# Altium schematic sheet 1_EVB-A32S1-M_Power.SchDoc
size A4; SheetNumber: 1; SheetTotal: 4
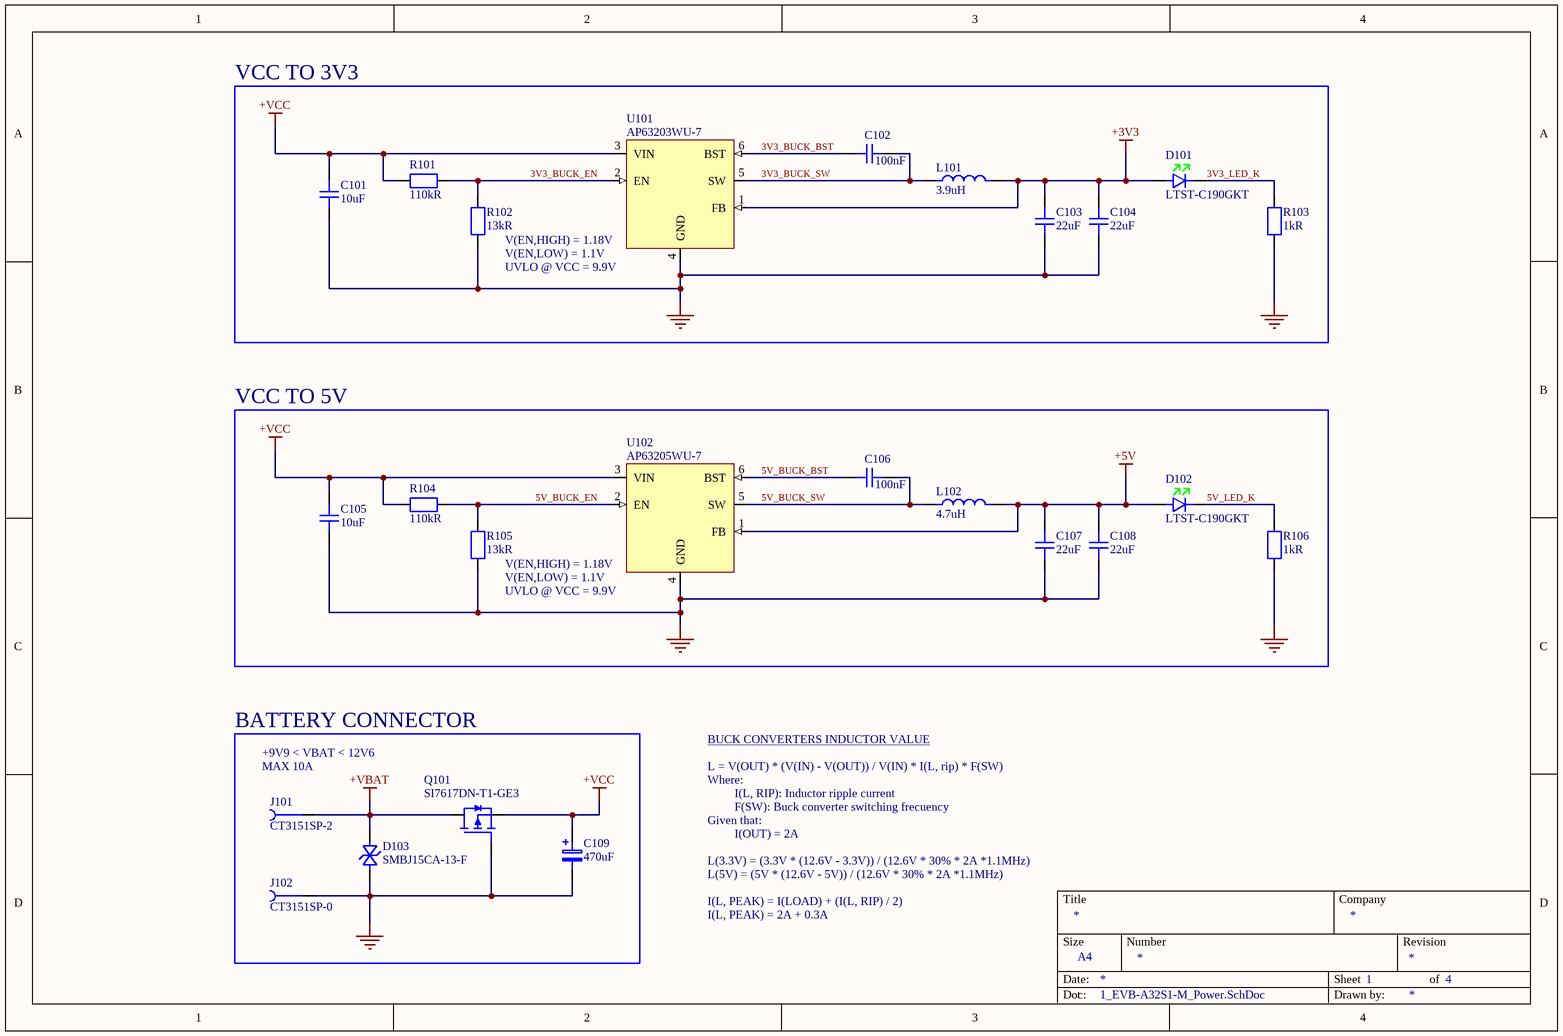
[diagram p0: 1_EVB-A32S1-M_Power.SchDoc]

## Parts
C101  value 10uF  [C_Samsung_CL_0805_A]  (hidden comment: CL21A106KOQNNNE)
C102  value 100nF  [C_Samsung_CL_0402_A]  (hidden comment: CL05B104KP5NNNC)
C103  value 22uF  [C_Yageo_CC_0805_A]  (hidden comment: CC0805MKX5R6BB226)
C104  value 22uF  [C_Yageo_CC_0805_A]  (hidden comment: CC0805MKX5R6BB226)
C105  value 10uF  [C_Samsung_CL_0805_A]  (hidden comment: CL21A106KOQNNNE)
C106  value 100nF  [C_Samsung_CL_0402_A]  (hidden comment: CL05B104KP5NNNC)
C107  value 22uF  [C_Yageo_CC_0805_A]  (hidden comment: CC0805MKX5R6BB226)
C108  value 22uF  [C_Yageo_CC_0805_A]  (hidden comment: CC0805MKX5R6BB226)
C109  value 470uF  [C_Rubycon_10x16mm_TH]  (hidden comment: 35ZLH470MEFC10X16)
D101  LTST-C190GKT  [D_LED_Lite-On_Green_0603_A]
D102  LTST-C190GKT  [D_LED_Lite-On_Green_0603_A]
D103  SMBJ15CA-13-F  [D_TVS_BI_Diodes_SMBJ15CA-13-F_A]
J101  CT3151SP-2  [J_CalTest_CT3151SP-2]
J102  CT3151SP-0  [J_CalTest_CT3151SP-0]
L101  value 3.9uH  [L_Murata_1255AY-XXXX=P3]  (hidden comment: 1255AY-3R9N=P3)
L102  value 4.7uH  [L_Murata_1255AY-XXXX=P3]  (hidden comment: 1255AY-4R7M=P3)
Q101  SI7617DN-T1-GE3  [Q_Vishay_PowerPACK-1212-8]
R101  value 110kR  [R_Yageo_RCL_0402_A]  (hidden comment: RC0402FR-07110KL)
R102  value 13kR  [R_Yageo_RCL_0402_A]  (hidden comment: RC0402FR-0713KL)
R103  value 1kR  [R_Yageo_RCL_0402_A]  (hidden comment: RC0402FR-071KL)
R104  value 110kR  [R_Yageo_RCL_0402_A]  (hidden comment: RC0402FR-07110KL)
R105  value 13kR  [R_Yageo_RCL_0402_A]  (hidden comment: RC0402FR-0713KL)
R106  value 1kR  [R_Yageo_RCL_0402_A]  (hidden comment: RC0402FR-071KL)
U101  AP63203WU-7  [U_Diodes_AP623xx]
U102  AP63205WU-7  [U_Diodes_AP623xx]

## Blocks framed on the sheet
VCC TO 3V3: C101-C104 D101 L101 R101-R103 U101
VCC TO 5V: C105-C108 D102 L102 R104-R106 U102
BATTERY CONNECTOR: C109 D103 J101 J102 Q101

## Nets
+3V3: C103.2 C104.2 D101.2 L101.2 U101.1(FB)
+5V: C107.2 C108.2 D102.2 L102.2 U102.1(FB)
+VBAT: D103.1 J101.1 Q101.1(D)
+VCC: C101.2 C105.2 C109.1 Q101.3(S) R101.2 R104.2 U101.3(VIN) U102.3(VIN)
GND: C101.1 C103.1 C104.1 C105.1 C107.1 C108.1 C109.2 D103.2 J102.1 Q101.2(G) R102.1 R103.1 R105.1 R106.1 U101.4(GND) U102.4(GND)
3V3_BUCK_BST: C102.2 U101.6(BST)
3V3_BUCK_EN: R101.1 R102.2 U101.2(EN)
3V3_BUCK_SW: C102.1 L101.1 U101.5(SW)
3V3_LED_K: D101.1 R103.2
5V_BUCK_BST: C106.2 U102.6(BST)
5V_BUCK_EN: R104.1 R105.2 U102.2(EN)
5V_BUCK_SW: C106.1 L102.1 U102.5(SW)
5V_LED_K: D102.1 R106.2

## Notes on the sheet
- (near U101) V(EN,HIGH) = 1.18V
- V(EN,LOW) = 1.1V
- (near U101) UVLO @ VCC = 9.9V
- (near U102) V(EN,HIGH) = 1.18V
- (near U102) UVLO @ VCC = 9.9V
- +9V9 < VBAT < 12V6
- (near J101) MAX 10A
- L = V(OUT) * (V(IN) - V(OUT)) / V(IN) * I(L, rip) * F(SW)
- BUCK CONVERTERS INDUCTOR VALUE
- Where:
- Given that:
- I(L, RIP): Inductor ripple current
- F(SW): Buck converter switching frecuency
- I(OUT) = 2A
- L(3.3V) = (3.3V * (12.6V - 3.3V)) / (12.6V * 30% * 2A *1.1MHz)
- L(5V) = (5V * (12.6V - 5V)) / (12.6V * 30% * 2A *1.1MHz)
- I(L, PEAK) = I(LOAD) + (I(L, RIP) / 2)
- I(L, PEAK) = 2A + 0.3A
- Title
- Company
- Size
- Date:
- A4
- Number
- Sheet
- Revision
- of
- Doc:
- Drawn by:

## Library data of the parts
C101 C105 = CMP-001-00022-4: Multilayer Ceramic Capacitor, 10 uF, 16 V, ± 10%, X5R, 0805 [2012 Metric]; Voltage Rating (DC): 16V; Dielectric: X7R; Radiation Hardening: No; Width: 0.049inch; Series: CL; Lead Free: Lead Free; Case/Package: 0805; Case Code (Metric): 2012; Construction: Flat; Height: 1.25mm; Voltage: 16V; Packaging: Tape and Reel; Voltage Rating: 16V; RoHS Compliant: Yes; Mounting Technology: Surface Mount; Case Code (Imperial): 0805; Length: 2mm; Min Operating Temperature: -55°C; Max Operating Temperature: 85°C; Depth: 1.25mm; Tolerance: 10%; Thickness: 0.055inch; ComponentLink1URL: https://mm.digikey.com/Volume0/opasdata/d220001/medias/docus/609/CL21A106KOQNNNE_Spec.pdf; Material: Ceramic; Package Quantity: 1; ComponentLink1Description: Datasheet
C102 C106 = CMP-001-00023-3: Multilayer Ceramic Capacitor, 0.1 uF, 10 V, ± 10%, X7R, 0402 [1005 Metric]; Voltage Rating: 10V; Dielectric: X7R; Height: 0.5mm; Tolerance: 10%; Voltage Rating (DC): 10V; Case/Package: 0402; RoHS Compliant: Yes; Packaging: Tape and Reel; Case Code (Imperial): 0402; Material: Ceramic; Case Code (Metric): 1005; Max Operating Temperature: 125°C; Mounting Technology: Surface Mount; Min Operating Temperature: -55°C; Series: CL; Construction: Flat; Depth: 0.5mm; Length: 1mm; Package Quantity: 1; Radiation Hardening: No; Thickness: 0.022inch; Width: 0.02inch
C103 C104 C107 C108 = CMP-001-00014-9: Multilayer Ceramic Capacitor, 22 uF, 10 V, ± 20%, X5R, 0805 [2012 Metric]; Voltage Rating (DC): 10V; Tolerance: 20%; ComponentLink1URL: https://www.yageo.com/upload/media/product/app/datasheet/mlcc/upy-gphc_x5r_4v-to-50v.pdf; Depth: 1.25mm; Width: 0.049inch; Termination: SMD/SMT; Packaging: Tape and Reel; Radiation Hardening: No; Min Operating Temperature: -55°C; RoHS Compliant: Yes; ComponentLink1Description: Datasheet; Length: 2mm; Dielectric: X5R; Case/Package: 0805; Case Code (Metric): 2012; Max Operating Temperature: 85°C; Weight: 0.000194oz; Case Code (Imperial): 0805; Lead Free: Lead Free; Mounting Technology: Surface Mount; Thickness: 0.057inch; Series: CC; Voltage Rating: 10V; Halogen Free: Halogen Free
C109 = CMP-001-00025-7: Cap Aluminum 470uF 35V 20% (10 X 16mm) Radial 5mm 1760mA 10000h 105 C Bulk; Life (Hours): 10000Hour; Lead Diameter: 0.6mm; Leakage Current: 3uA; Dielectric Material: Aluminium; Ripple Current: 1.76A; Impedance: 28mR; Tolerance: 20%; Construction: RADIAL; Voltage: 35V; Radiation Hardening: No; Lead Pitch: 5mm; Reach SVHC Compliant: No; Case/Package: Radial; Diameter: 10mm; Series: ZLH; Voltage Rating: 35V; Lead Free: Lead Free; Max Operating Temperature: 105°C; ComponentLink1URL: https://www.rubycon.co.jp/wp-content/uploads/catalog-aluminum/ZLH.pdf; Voltage Rating (AC): 35V; Min Operating Temperature: -40°C; Mounting Technology: Through Hole; Height: 16mm; RoHS Compliant: Yes; Termination: Radial; ComponentLink1Description: Datasheet; Packaging: Bulk
D101 D102 = CMP-007-00001-3: LED Uni-Color Green 565nm 2-Pin Chip LED T/R; Forward Current: 30mA; Forward Voltage: 2.1V; Luminous Intensity: 6mcd; Lens Transparency: Clear; Power Dissipation: 100mW; Lens Style: Flat,Diffused,Colorless,Rectangular,Clear; Lens Size: 0.8mm; Reverse Voltage: 5V; Viewing Angle: 130°; Test Current: 10mA; Dominant Wavelength: 569nm; Lens Color: Colorless; Number of Elements: 1; Voltage: 2V; Case Code (Imperial): 0603; Min Operating Temperature: -55°C; Case/Package: 0603; RoHS Compliant: Yes; Color: Green; Mounting Technology: Surface Mount; Case Code (Metric): 1608; Series: -; Width: 0.8mm; Packaging: Tape and Reel; Max Operating Temperature: 85°C; ComponentLink1Description: Datasheet; Length: 1.6mm; Package Quantity: 1; Height: 0.9mm; ComponentLink1URL: https://mm.digikey.com/Volume0/opasdata/d220001/medias/docus/858/LTST-C190GKT.pdf; Wavelength: 565nm; Depth: 0.8mm; Illumination Color: Green; Lead Free: Lead Free; Number of LEDs: 1; Pins: 2; Power Rating: 100mW; Radiation Hardening: No
D103 = CMP-004-00000-11: Tvs Diode, Bidir, 15V, 600W, Do-214Aa Rohs Compliant: Yes; Max Reverse Leakage Current: 5uA; Reverse Breakdown Voltage: 16.7V; Breakdown Voltage: 19.2V; Clamping Voltage: 24.4V; Power Line Protection: No; Max Surge Current: 24A; Number of Bidirectional Channels: 1; Test Current: 1mA; Value: 280pF; Polarity: Bidirectional; Diode Type: ZENER; Power Dissipation: 600W; Max Operating Temperature: 150°C; Package Quantity: 3000; Min Breakdown Voltage: 16.7V; Width: 3.9mm; Series: SMBJ; Peak Pulse Power: 600W; Mounting Technology: Surface Mount; Working Voltage: 15V; Peak Pulse Current: 24A; Min Operating Temperature: -55°C; Max Output current: 24A; Pins: 2; Termination: SMD/SMT; Leakage Current: 5uA; ComponentLink1Description: Datasheet; Max Breakdown Voltage: 19.2V; Case/Package: SMB; Number of Elements: 1; Max Power Dissipation: 600W; ComponentLink1URL: https://www.bourns.com/docs/Product-Datasheets/SMBJ.pdf; Lead Free: Lead Free; Packaging: Tape and Reel; Clamping Voltage-Max: 24.4V; RoHS Compliant: Yes; Length: 4.57mm; Voltage Rating (DC): 15V; Direction: Bidirectional; Radiation Hardening: No; Height: 2.62mm; Reverse Standoff Voltage: 15V
J101 = CMP-002-00001-14: Conn 4mm Safety Banana Jack F 1 POS Solder RA Thru-Hole 1 Port Bag; pin to pad: 1>1+2+3+4; Body Material: Nylon,Polyamide,PA66; Insulation: Mating End Insulated; Gender: Female; Min Operating Temperature: -20°C; Termination: Solder; ComponentLink1Description: Datasheet; Mounting Technology: Through Hole,Panel; Max Operating Temperature: 80°C; Color: Red; ComponentLink1URL: https://mm.digikey.com/Volume0/opasdata/d220001/medias/docus/4846/DS_1768_Catalog.pdf; Contact Material: Brass; Contact Plating: Nickel; Series: Cal Test; Packaging: Bulk
J102 = CMP-002-00000-17: Conn 4mm Safety Banana Jack F 1 POS Solder RA Thru-Hole 1 Port Bag; pin to pad: 1>1+2+3+4; Body Material: Nylon,Polyamide,PA66; Insulation: Mating End Insulated; Gender: Female; Packaging: Bulk; Series: Cal Test; Color: Black; Min Operating Temperature: -20°C; Contact Material: Brass; ComponentLink1URL: https://mm.digikey.com/Volume0/opasdata/d220001/medias/docus/4846/DS_1768_Catalog.pdf; Mounting Technology: Through Hole,Panel; Contact Plating: Nickel; ComponentLink1Description: Datasheet; Max Operating Temperature: 80°C; Termination: Solder
L101 = CMP-006-00002-7: Inductor Power Shielded Wirewound 3.9uH 30% 100KHz Ferrite 4.2A 0.0264Ohm DCR 2424 T/R; DC Resistance (DCR): 26.4mR; Saturation Current: 4.7A; Core Material: Ferrite; Tolerance: 30%; Shielding: Shielded; Length: 0.248inch; Packaging: Cut Tape; Min Operating Temperature: -40°C; ComponentLink1URL: https://search.murata.co.jp/Ceramy/image/img/P02/J(E)TE243B-0037_DG6045C_reference.pdf; RoHS Compliant: Yes; ComponentLink1Description: Datasheet; Height - Seated (Max): 0.177inch; Max Operating Temperature: 85°C; Mounting Technology: Surface Mount; Series: -; Case/Package: Nonstandard; Width: 0.248inch; Current Rating: 4.2A; Test Frequency: 100kHz
L102 = CMP-006-00001-10: Inductor Power Shielded Wirewound 4.7uH 20% 100KHz Ferrite 4A 0.0276Ohm DCR 2424 T/R; DC Resistance (DCR): 27.6mR; Current Rating: 4.5A; ComponentLink1Description: Datasheet; Packaging: Cut Tape; Height - Seated (Max): 0.177inch; ESR: 27.6mR; Core Material: Ferrite; Inductance Tolerance: 20%; ComponentLink1URL: https://search.murata.co.jp/Ceramy/image/img/P02/J(E)TE243B-0037_DG6045C_reference.pdf; Width: 0.248inch; Saturation Current: 4.5A; Min Operating Temperature: -40°C; Case/Package: Nonstandard; Series: DG6045C; RoHS Compliant: Yes; Tolerance: 20%; Length: 0.248inch; Test Frequency: 100kHz; Shielding: Shielded; Max Operating Temperature: 85°C; Height: 4.5mm; Max DC Current: 4A; RMS Current (Irms): 4A; Mounting Technology: Surface Mount
Q101 = CMP-00000-19: P CHANNEL MOSFET, -30V, 35A; Transistor; Transistor Polarity: P Channel; Continuous Drain Current Id: -35A; Source; pin to pad: 1>5+6+7+8 2>4 3>1+2+3; Rise Time: 43ns; Drain to Source Resistance: 12.3mR; Turn-Off Delay Time: 30ns; Turn-On Delay Time: 40ns; Threshold Voltage: -2.5V; Max Power Dissipation: 52W; Fall Time: 11ns; Power Dissipation: 3.7W; Polarity: P-CHANNEL; Number of Elements: 1; Input Capacitance: 1.8nF; Gate to Source Voltage (Vgs): 25V; Drain to Source Breakdown Voltage: -30V; Pins: 8; Max Operating Temperature: 150°C; ComponentLink1Description: Datasheet; Continuous Drain Current (ID): -35A; Mounting Technology: Surface Mount; Rds On Max: 12.3mR; Packaging: Tape and Reel; ComponentLink1URL: https://www.vishay.com/docs/65164/si7617dn.pdf; Min Operating Temperature: -55°C; Reach SVHC Compliant: No; Drain to Source Voltage (Vdss): -30V; RoHS Compliant: Yes; Package Quantity: 3000; Number of Channels: 1; Lead Free: Lead Free; Series: TrenchFET®; Radiation Hardening: No; Height: 1.12mm
R101 R104 = CMP-009-00000-11: SMD Chip Resistor, 110 kOhm, ± 1%, 63 mW, 0402 [1005 Metric], Thick Film, General Purpose; Max Power Dissipation: 63mW; Voltage Rating (DC): 50V; Temperature Coefficient: 100ppm/°C; Tolerance: 1%; Case Code (Metric): 1005; Case/Package: 0402; ComponentLink1Description: Datasheet; Depth: 0.5mm; Length: 1mm; Packaging: Tape and Reel; Max Operating Temperature: 155°C; Reach SVHC Compliant: Unknown; Case Code (Imperial): 0402; ComponentLink1URL: https://www.yageo.com/upload/media/product/products/datasheet/rchip/PYu-RC_Group_51_RoHS_L_12.pdf; Termination: SMD/SMT; Construction: Rectangular; RoHS Compliant: Yes; Min Operating Temperature: -55°C; Working Voltage: 50V; Technology: THICK FILM; Resistor Type: Thick Film; Military Standard: Not; Number of Terminations: 2; Voltage Rating: 50V; Series: RC; Power Rating: 63mW; Features: Moisture Resistant; Resistance Tolerance: 1%
R102 R105 = CMP-009-00001-11: SMD Chip Resistor, 13 kOhm, ± 1%, 63 mW, 0402 [1005 Metric], Thick Film, General Purpose; Temperature Coefficient: 100ppm/°C; Voltage Rating: 50V; Max Power Dissipation: 63mW; Power Rating: 62.5mW; ComponentLink1Description: Datasheet; Mounting Technology: Surface Mount; Max Operating Temperature: 155°C; Technology: THICK FILM; Package Quantity: 10000; Case Code (Imperial): 0402; Number of Terminations: 2; Lead Free: Lead Free; Working Voltage: 50V; Min Operating Temperature: -55°C; Width: 0.02inch; Height: 0.016inch; Tolerance: 1%; Packaging: Tape and Reel; Length: 0.039inch; Features: Moisture Resistant; Case Code (Metric): 1005; Case/Package: 0402; Depth: 0.5mm; Termination: SMD/SMT; ComponentLink1URL: https://www.yageo.com/upload/media/product/products/datasheet/rchip/PYu-RC_Group_51_RoHS_L_12.pdf; Voltage Rating (DC): 50V; Series: RC; RoHS Compliant: Yes
R103 R106 = CMP-009-00002-11: SMD Chip Resistor, 1 kOhm, ± 1%, 62.5 mW, 0402 [1005 Metric], Thick Film, General Purpose; Temperature Coefficient: 100ppm/°C; Voltage Rating (AC): 50V; Power Rating: 62.5mW; Max Power Dissipation: 63mW; Features: Moisture Resistant; Width: 0.5mm; Resistor Type: Thick Film; Packaging: Tape and Reel; Max Operating Temperature: 155°C; Construction: Rectangular; Reach SVHC Compliant: No; Termination: SMD/SMT; Voltage Rating (DC): 50V; Tolerance: 1%; ComponentLink1Description: Datasheet; Number of Terminations: 2; Depth: 0.5mm; Resistance Tolerance: 1%; ComponentLink1URL: https://www.yageo.com/upload/media/product/products/datasheet/rchip/PYu-RC_Group_51_RoHS_L_12.pdf; Height: 0.32mm; Technology: THICK FILM; RoHS Compliant: Yes; Min Operating Temperature: -55°C; Lead Free: Lead Free; Military Standard: Not; Series: RC; Case/Package: 0402; Case Code (Imperial): 0402; Pins: 2; Case Code (Metric): 1005; Voltage Rating: 50V; Length: 1mm
U101 = CMP-019-00004-17: AP63203 Series 3.3 V 2 A SMT Fixed Low IQ Synchronous Buck - TSOT-26; Max Duty Cycle: 100%; Output Voltage: 3.3V; Number of Outputs: 1; Max Supply Voltage: 32V; Switching Frequency: 1.1MHz; Min Supply Voltage: 3.8V; Nominal Supply Current: 22uA; Output Current: 2A; Min Operating Temperature: -40°C; ComponentLink1URL: https://www.diodes.com/assets/Datasheets/AP63200-AP63201-AP63203-AP63205.pdf; ComponentLink1Description: Datasheet; Max Operating Temperature: 85°C; Height: 1mm
U102 = CMP-019-00003-17: AP63205 Series 32 V 2 A 1.1 MHz Synchronous Buck Converter -TSOT-26; Number of Outputs: 1; Max Duty Cycle: 100%; Output Current: 2A; Switching Frequency: 1.1MHz; Max Supply Voltage: 32V; Output Voltage: 5V; Nominal Supply Current: 22uA; Min Supply Voltage: 3.8V; ComponentLink1URL: https://www.diodes.com/assets/Datasheets/AP63200-AP63201-AP63203-AP63205.pdf; Min Operating Temperature: -40°C; Height: 1mm; Max Operating Temperature: 85°C; ComponentLink1Description: Datasheet